# EasyEDA Pro project usb-seal.epro

# Schematic Schematic1
Board Name: Board1; Create Date: 2026-08-11; Page Name: P1; Project Name: usb-hub; Schematic Name: Schematic1; Update Date: 2026-08-11; Company: EasyEDA.com; Page Size: A4; Version: V1.0
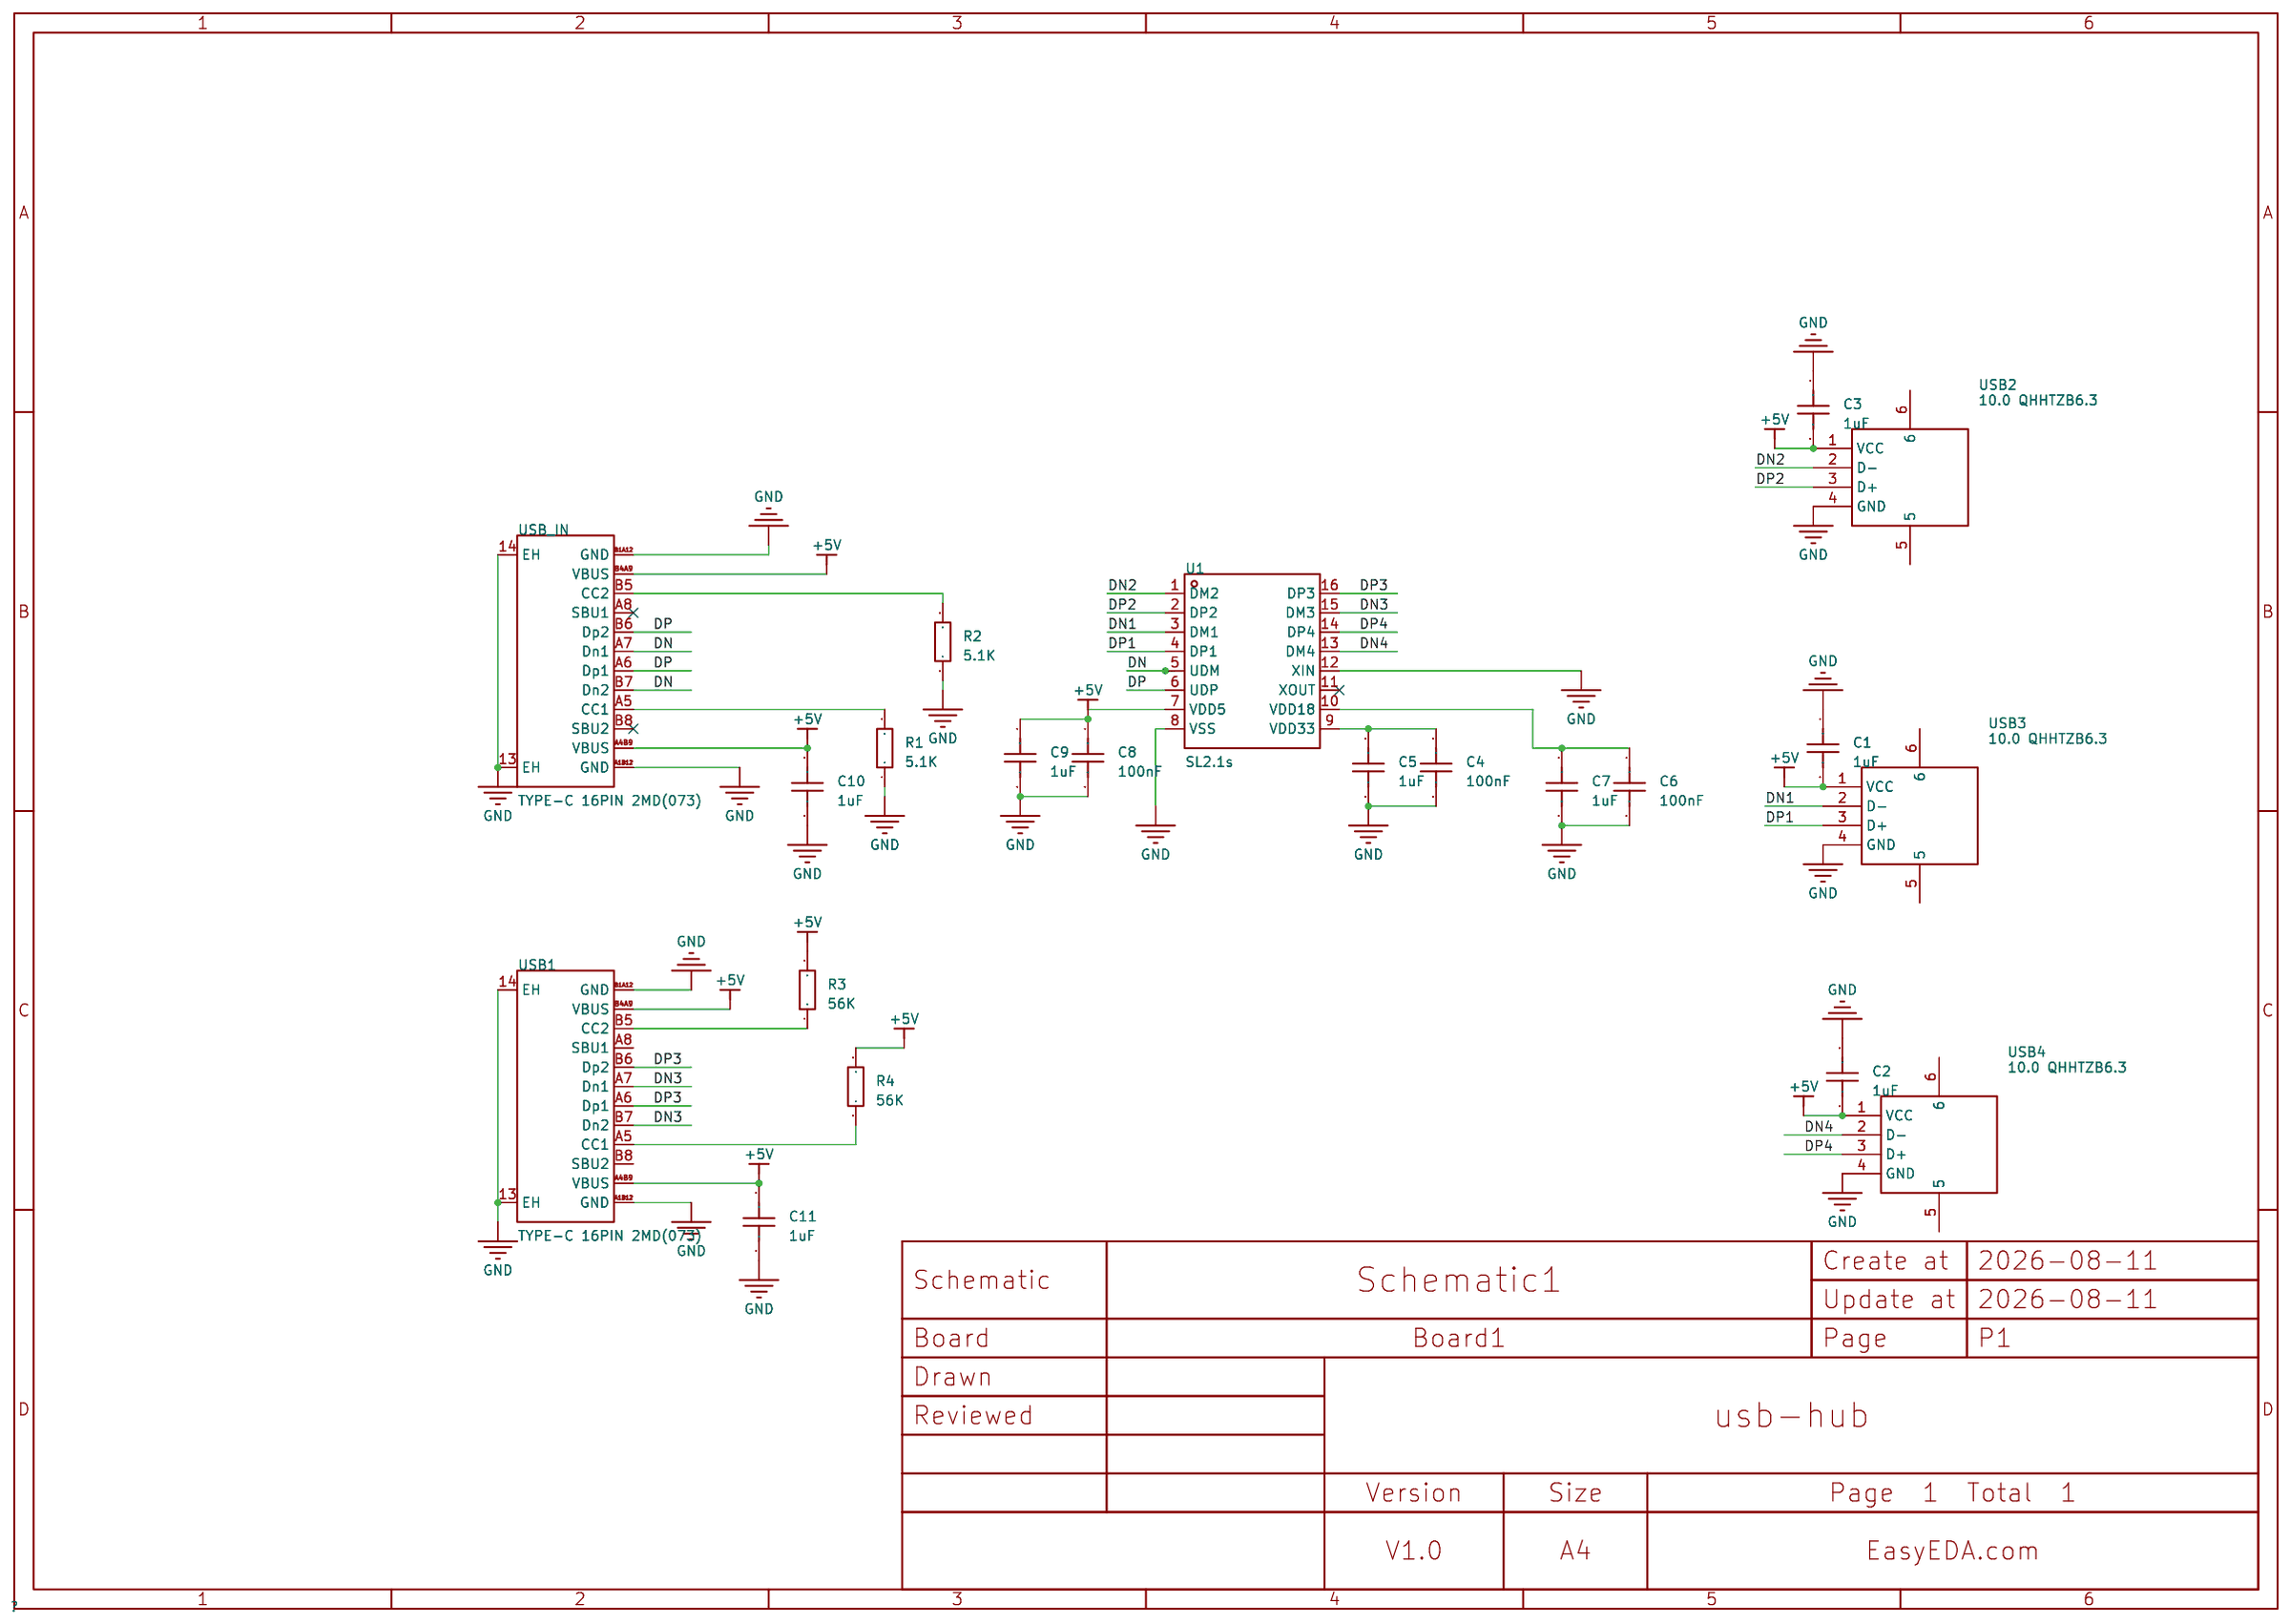
[diagram p0: schematic sheet]

## Parts
C1  1uF  [C0603]
C2  1uF  [C0603]
C3  1uF  [C0603]
C4  100nF  [C0603]
C5  1uF  [C0603]
C6  100nF  [C0603]
C7  1uF  [C0603]
C8  100nF  [C0603]
C9  1uF  [C0603]
C10  1uF  [C0603]
C11  1uF  [C0603]
R1  5.1K  [R0603]
R2  5.1K  [R0603]
R3  56K  [R0603]
R4  56K  [R0603]
U1  SL2.1s  [SSOP-16_L4.6-W2.6-P0.53-LS4.0-BL]
USB1  TYPE-C 16PIN 2MD(073)  [USB-C-SMD_TYPE-C-16PIN-2MD-073]
USB2  10.0 QHHTZB6.3  [USB-A-TH_10.0QHHTZB6.3]
USB3  10.0 QHHTZB6.3  [USB-A-TH_10.0QHHTZB6.3]
USB4  10.0 QHHTZB6.3  [USB-A-TH_10.0QHHTZB6.3]
USB_IN  TYPE-C 16PIN 2MD(073)  [USB-C-SMD_TYPE-C-16PIN-2MD-073]

## Library data of the parts
C1-C11 = CAP_0603: Supplier Footprint: 0603
R1-R4 = Res_0603: Supplier Footprint: 0603
U1 = SL2.1s: type:Hub USB Protocol:USB 2.0 Data Rate:- Voltage - Supply:4V~5.25V Voltage - Supply:4V~5.25V Operating Temperature:0℃~+70℃ Operating Temperature:0℃~+70℃ Memory Interface:- Current - Supply:120mA Quiescent Supply Current:2.5mA Number of Channels:4; LCSC Part Name: USB2.0 HUB控制器集成电路; Supplier Part: C2684433; Manufacturer: CoreChips(和芯润德); Supplier Footprint: SSOP-16; JLCPCB Part Class: Extended Part; Datasheet: https://item.szlcsc.com/datasheet/SL2.1s/2782346.html; Supplier: LCSC; type: Hub; USB Protocol: USB 2.0; Voltage - Supply: 4V~5.25V; Operating Temperature: 0℃~+70℃; Current - Supply: 120mA; Quiescent Supply Current: 2.5mA; Number of Channels: 4
USB1 USB_IN = TYPE-C 16PIN 2MD(073): Connector Type:Type-C Protocol Standard:- Gender:Female Mounting Type:Surface Mount, Right Angle Number of Contacts:16P Number of Ports:1 Current Rating-Power:3A Voltage Rating:5V Connect-Disconnect Life:10,000 cycles Supplementary Features:- Center Heigh; LCSC Part Name: Type-C 母 卧贴; Supplier Part: C2765186; Manufacturer: SHOU HAN(首韩); Supplier Footprint: SMD; JLCPCB Part Class: Extended Part; Datasheet: https://item.szlcsc.com/datasheet/TYPE-C%252016PIN%25202MD(073)/2901843.html; Supplier: LCSC; Connector Type: Type-C; Gender: Female; Mounting Type: Surface Mount, Right Angle; Number of Contacts: 16P; Number of Ports: 1; Current Rating-Power: 3A; Voltage Rating: 5V; Connect-Disconnect Life: 10,000 cycles; Detection color: Black; Operating Temperature: -25℃~+85℃
USB2-USB4 = 10.0 QHHTZB6.3: Connector Type:Type-A Protocol Standard:USB 2.0 Gender:Female Mounting Type:Surface Mount, Right Angle Number of Contacts:4P Number of Ports:1 Current Rating-Power:1.5A Voltage Rating:30V Connect-Disconnect Life:5,000 times Supplementary Features:- Center; LCSC Part Name: 壳长10.0mm; Supplier Part: C668591; Manufacturer: SHOU HAN(首韩); Supplier Footprint: SMD; JLCPCB Part Class: Extended Part; Datasheet: https://item.szlcsc.com/datasheet/10.0%2520QHHTZB6.3/698534.html; Supplier: LCSC; Connector Type: Type-A; Protocol Standard: USB 2.0; Gender: Female; Mounting Type: Surface Mount, Right Angle; Number of Contacts: 4P; Number of Ports: 1; Current Rating-Power: 1.5A; Voltage Rating: 30V; Connect-Disconnect Life: 5,000 times; Length: 10mm; Detection color: Black; Operating Temperature: -25℃~+85℃

## Nets
+5V: C1.2 C2.2 C3.2 C8.1 C9.1 C10.2 C11.2 R3.2 R4.2 U1.7(VDD5) USB1.A4B9(VBUS) USB1.B4A9(VBUS) USB2.1(VCC) USB3.1(VCC) USB4.1(VCC) USB_IN.A4B9(VBUS) USB_IN.B4A9(VBUS)
GND: C1.1 C2.1 C3.1 C4.2 C5.2 C6.2 C7.2 C8.2 C9.2 C10.1 C11.1 R1.1 R2.1 U1.8(VSS) U1.12(XIN) USB1.13(EH) USB1.14(EH) USB1.A1B12(GND) USB1.B1A12(GND) USB2.4(GND) USB3.4(GND) USB4.4(GND) USB_IN.13(EH) USB_IN.14(EH) USB_IN.A1B12(GND) USB_IN.B1A12(GND)
DN: U1.5(UDM) USB_IN.A7(Dn1) USB_IN.B7(Dn2)
DN1: U1.3(DM1) USB3.2(D-)
DN2: U1.1(DM2) USB2.2(D-)
DN3: U1.15(DM3) USB1.A7(Dn1) USB1.B7(Dn2)
DN4: U1.13(DM4) USB4.2(D-)
DP: U1.6(UDP) USB_IN.A6(Dp1) USB_IN.B6(Dp2)
DP1: U1.4(DP1) USB3.3(D+)
DP2: U1.2(DP2) USB2.3(D+)
DP3: U1.16(DP3) USB1.A6(Dp1) USB1.B6(Dp2)
DP4: U1.14(DP4) USB4.3(D+)
$1N12: R1.2 USB_IN.A5(CC1)
$1N15: R2.2 USB_IN.B5(CC2)
$1N69: R3.1 USB1.B5(CC2)
$1N70: R4.1 USB1.A5(CC1)
$1N80: C4.1 C5.1 U1.9(VDD33)
$1N83: C6.1 C7.1 U1.10(VDD18)

Not connected (* = marked no-connect by the designer): U1 11(XOUT)*; USB1 A8(SBU1) B8(SBU2); USB2 5 6; USB3 5 6; USB4 5 6; USB_IN A8(SBU1)* B8(SBU2)*

# Board PCB1
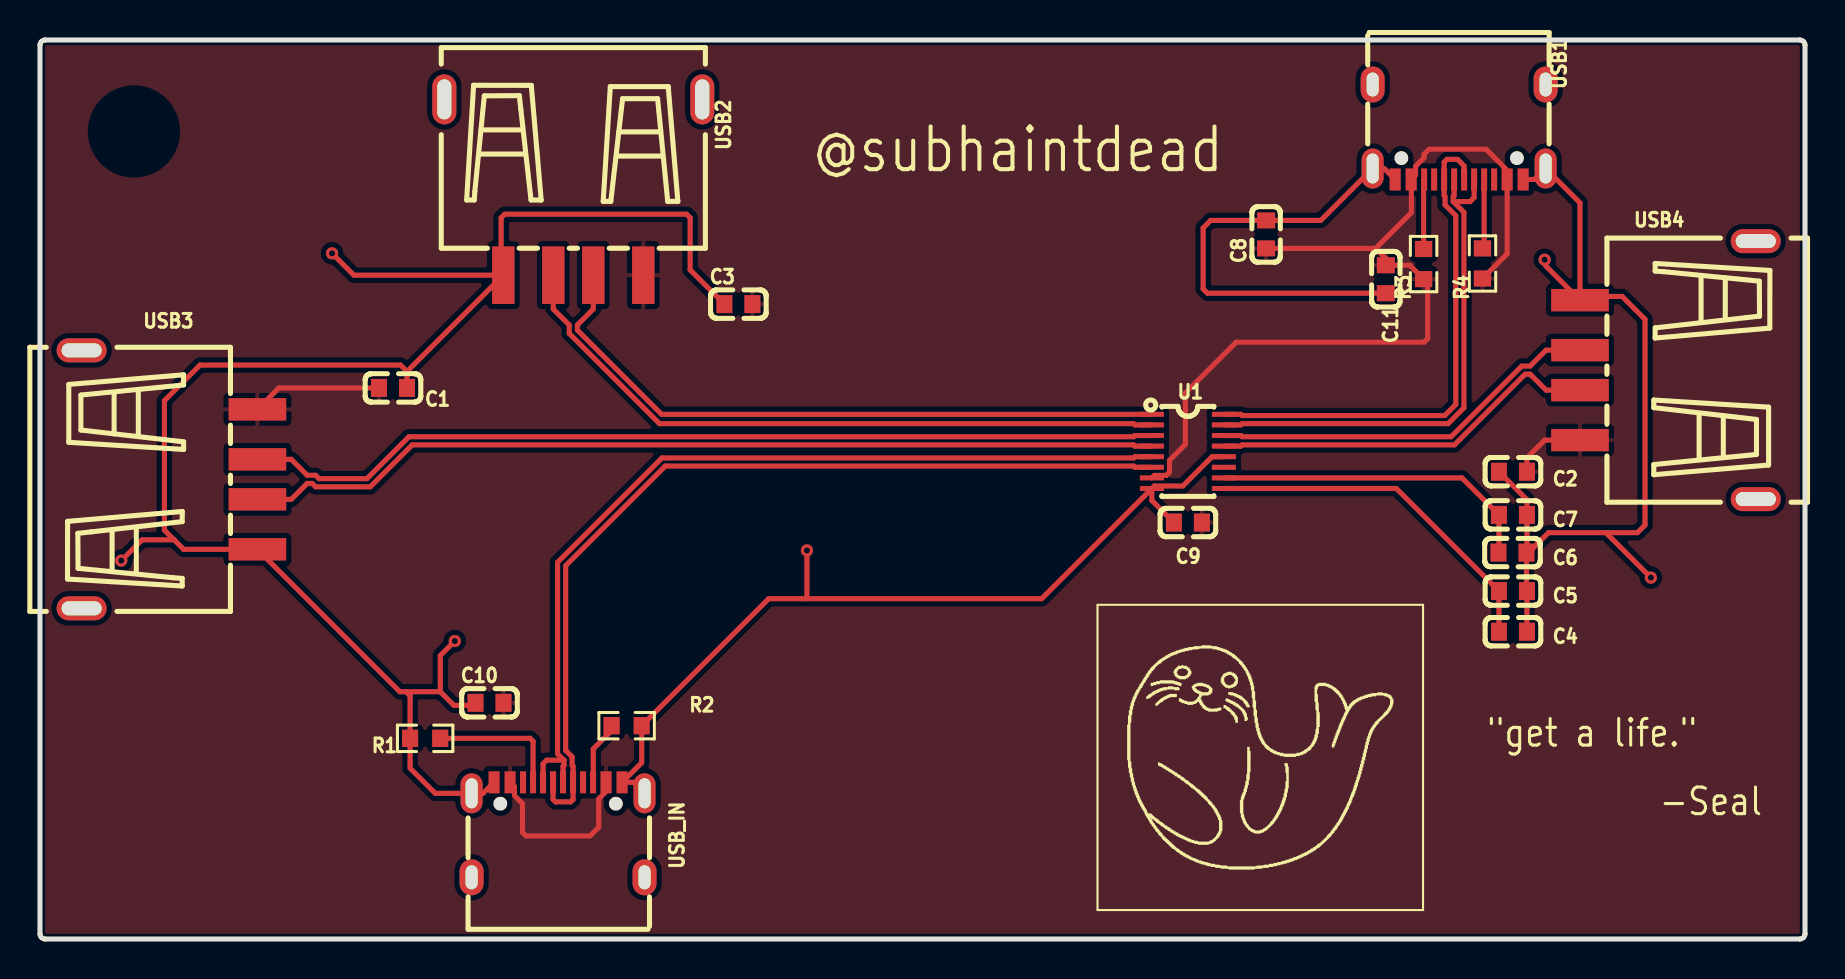
[diagram p1: board, top side]
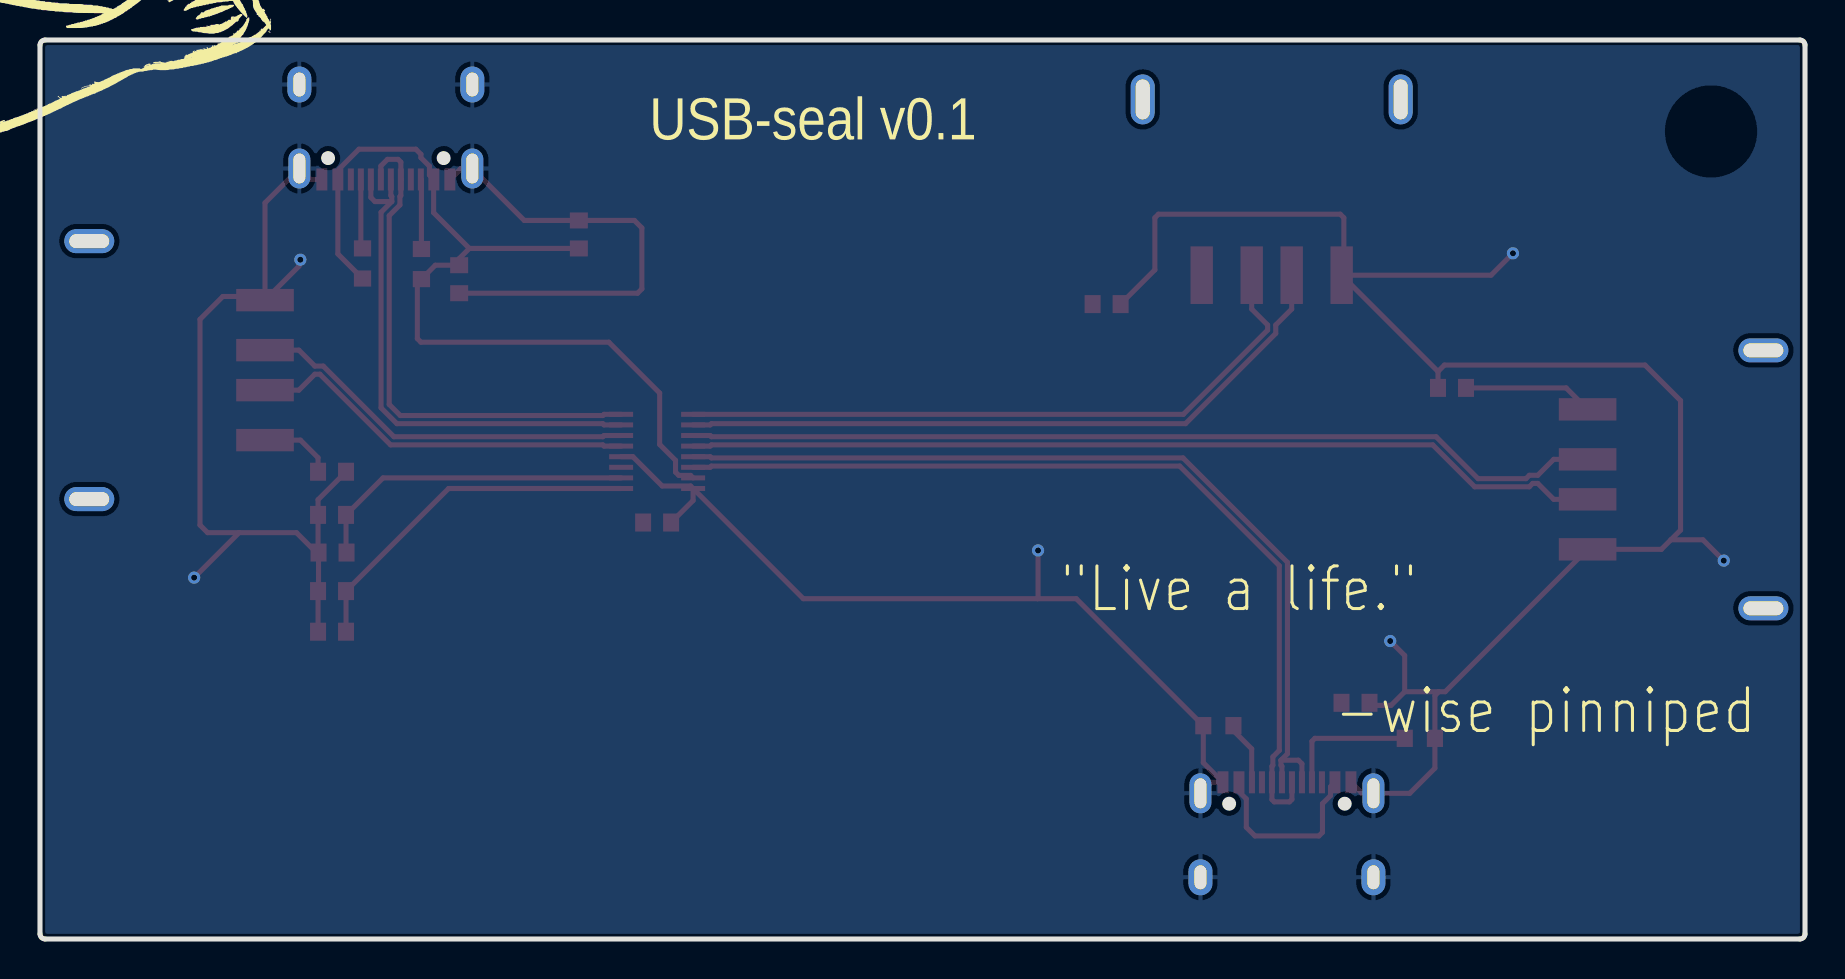
[diagram p2: board, bottom side, seen from below]

Outline 88.27 x 44.96 mm; copper layers: Top Layer, Bottom Layer. Coordinates in mm from the lower left corner of the outline.
Outline path: 0,44.7 0,0.25 arc(0.07,0.07) 0.25,0 88.01,0 arc(88.19,0.07) 88.27,0.25 88.27,44.7 arc(88.19,44.88) 88.01,44.96 0.25,44.96 arc(0.07,44.88) 0,44.7
Stack: Top Layer 0.035mm / Dielectric1 1.51mm FR4 er 4.5 / Bottom Layer 0.035mm

## Design rules (mm)
net DN2: DP4
net DP2: DP4
net DN1: DP5
net DP1: DP5
net DN: DP1
net DP: DP1
net DN4: DP2
net DP4: DP2
net DN3: DP3
net DP3: DP3
spacing copperThickness1oz (default): track to track 0.102, other pairs 0.152 to 0.3
spacing copperThickness2oz: track to track 0.203, other pairs 0.152 to 0.3
track width copperThickness1oz (default): min 0.127, default 0.254, max 2.54
track width copperThickness2oz: min 0.203, default 0.254, max 2.54
differential pair differentialPair (default): width min 0.127, default 0.254, max 2.54; gap min 0.152, default 0.152
net GND uses copperRegion
net +5V uses copperRegion

## Placement (name value [footprint] x y rotation side)
C1  1uF  [C0603]  17.65 27.56 180 top
C2  1uF  [C0603]  73.66 23.37 0 top
C3  1uF  [C0603]  34.92 31.75 0 top
C4  100nF  [C0603]  73.66 15.37 0 top
C5  1uF  [C0603]  73.66 17.4 0 top
C6  100nF  [C0603]  73.64 19.32 0 top
C7  1uF  [C0603]  73.66 21.21 0 top
C8  100nF  [C0603]  61.32 35.23 90 top
C9  1uF  [C0603]  57.4 20.83 180 top
C10  1uF  [C0603]  22.48 11.81 0 top
C11  1uF  [C0603]  67.3 32.99 90 top
R1  5.1K  [R0603]  19.26 10.04 0 top
R2  5.1K  [R0603]  29.34 10.67 180 top
R3  56K  [R0603]  69.19 33.75 270 top
R4  56K  [R0603]  72.14 33.78 270 top
U1  SL2.1s  [SSOP-16_L4.6-W2.6-P0.53-LS4.0-BL]  57.4 24.38 270 top
USB1  TYPE-C 16PIN 2MD(073)  [USB-C-SMD_TYPE-C-16PIN-2MD-073]  70.97 40.36 180 top
USB2  10.0 QHHTZB6.3  [USB-A-TH_10.0QHHTZB6.3]  26.67 37.59 180 top
USB3  10.0 QHHTZB6.3  [USB-A-TH_10.0QHHTZB6.3]  6.48 22.99 270 top
USB4  10.0 QHHTZB6.3  [USB-A-TH_10.0QHHTZB6.3]  81.41 28.45 90 top
USB_IN  TYPE-C 16PIN 2MD(073)  [USB-C-SMD_TYPE-C-16PIN-2MD-073]  25.91 5.46 0 top

## Footprints (pads in the part's own frame, mm; a bottom-side part is the same pattern mirrored in y, then rotated)
C0603
  rect 0.8x0.9 smd: 1(-0.7,0) 2(0.7,0)
R0603
  rect 0.806x0.864 smd: 1(-0.753,0) 2(0.753,0)
SSOP-16_L4.6-W2.6-P0.53-LS4.0-BL
  rect 0.25x1.2 smd: 1(-1.855,-1.8) 2(-1.325,-1.8) 3(-0.795,-1.8) 4(-0.265,-1.8) 5(0.265,-1.8) 6(0.795,-1.8) 7(1.325,-1.8) 8(1.855,-1.8) 9(1.855,1.8) 10(1.325,1.8) 11(0.795,1.8) 12(0.265,1.8) 13(-0.265,1.8) 14(-0.795,1.8) 15(-1.325,1.8) 16(-1.855,1.8)
USB-A-TH_10.0QHHTZB6.3
  rect 1.12x2.88 smd: 1(-3.5,4.395) 2(-1,4.395) 3(1,4.395) 4(3.5,4.395)
  oval 1.2x2.5 hole 0.7x2: 5(-6.45,-4.395) 6(6.45,-4.395)
USB-C-SMD_TYPE-C-16PIN-2MD-073
  oval 1.1x2 hole 0.6x1.5: 13(-4.325,1.825) 14(4.325,1.825)
  oval 1.2x1.8 hole 0.6x1.2: 13(-4.325,-2.375) 14(4.325,-2.375)
  rect 0.55x1.1 smd: A1B12(-3.2,2.375) A4B9(-2.4,2.375) B1A12(3.2,2.375) B4A9(2.4,2.375)
  rect 0.3x1.1 smd: A5(-1.25,2.375) A6(-0.25,2.375) A7(0.25,2.375) A8(1.25,2.375) B5(1.75,2.375) B6(0.75,2.375) B7(-0.75,2.375) B8(-1.75,2.375)

## Nets
As in the schematic.

Pads without a net: U1 11; USB1 A8 B8; USB2 5 6; USB3 5 6; USB4 5 6; USB_IN A8 B8

## Via types
v1: diameter 0.61, hole 0.305, Top Layer to Bottom Layer, 6 vias

## Routing (per net, layer and track width the routed paths; a pad name or vN(x,y) marks a point on that pad's centre or on a via; arc(x,y) is an arc through that point)
+5V: length 65.1
  Top Layer w0.254: 77.01,24.95 75.24,24.95 74.36,24.07 C2.2 ; 73.3,38.51 72.32,39.5 69.47,39.5 69.22,39.24 69.22,39.07 68.79,38.65 68.79,38.2 USB1.B4A9 68.58,37.97 68.58,36.32 66.79,34.53 ; R4.2 73.37,34.26 USB1.A4B9 ; C8.1 66.79,34.53 ; 66.79,34.53 67.3,34.02 C11.2 68.5,33.69 R3.2 69.39,32.8 69.39,30.02 69.22,29.84 59.82,29.84 57.28,27.3 57.28,24.73 56.48,23.94 56.48,23.35 56.32,23.18 55.73,23.18 U1.7 ; C1.2 11.94,27.56 USB3.1 ; 23.51,7.84 23.73,7.61 23.73,7.17 24.13,6.77 24.13,5.33 24.31,5.15 27.51,5.15 27.94,5.59 27.94,7.01 28.31,7.38
GND: length 198.6
  Top Layer w0.254: 18.31,12.37 18.51,12.17 R1.1 18.51,8.54 19.77,7.29 USB_IN.13 22.16,7.29 USB_IN.A1B12 ; 18.31,12.37 17.99,12.37 USB3.4 7.18,19.49 6.71,19.96 ; 18.31,12.37 20.02,12.37 ; 55.6,22.53 55.6,21.93 C9.2 ; 55.6,22.53 50.09,17.02 38.38,17.02 ; 55.6,22.53 55.73,22.65 57.15,22.65 58.61,24.12 U1.12 ; v1(75.25,33.97) 75.31,33.9 75.31,33.65 77.01,31.95 ; 77.01,31.95 77.2,32.13 79.12,32.13 80.26,30.99 80.26,20.7 79.88,20.32 78.31,20.32 ; 77.01,31.95 77.01,36.81 USB1.13 74.74,37.98 USB1.A1B12 ; USB2.4 18.35,28.38 ; USB2.4 23.06,33.31 23.06,36.07 23.24,36.25 32.33,36.25 32.51,36.07 32.51,33.46 C3.1 ; USB2.4 15.7,33.2 v1(14.61,34.29) ; 18.35,28.38 18.03,28.7 8,28.7 6.22,26.92 6.22,20.45 6.71,19.96 ; 18.35,28.38 C1.1 ; v1(4.06,18.92) 5.11,19.96 6.71,19.96 ; 74.49,19.37 74.44,19.32 C6.2 74.34,17.42 C5.2 C4.2 ; 74.49,19.37 75.44,20.32 78.31,20.32 ; 74.49,19.37 74.36,19.49 C7.2 74.36,21.97 C2.1 ; 20.02,12.37 20.02,14.18 v1(20.74,14.9) ; 20.02,12.37 20.7,11.68 21.65,11.68 C10.1 ; USB1.B1A12 67.22,38.53 USB1.14 64.05,35.93 C8.2 58.54,35.93 58.17,35.56 58.17,32.51 58.38,32.29 C11.1 ; 78.31,20.32 v1(80.56,18.07) ; 38.38,17.02 36.44,17.02 R2.1 30.09,8.82 29.11,7.84 29.68,7.84 USB_IN.14 ; 38.38,17.02 38.35,17.04 v1(38.35,19.43)
DN: length 45.1
  Top Layer w0.254: USB_IN.B7 25.16,8.76 25.34,8.94 26.2,8.94 ; 26.2,8.94 25.88,9.26 25.88,18.84 31.1,24.06 54.69,24.06 54.75,24.12 U1.5 ; 26.2,8.94 26.2,8.94 26.2,8.69 26.16,8.64 USB_IN.A7
DN1: length 46
  Top Layer w0.254: USB3.2 12.57,23.99 13.36,23.19 13.79,23.19 13.95,23.02 16.35,23.02 18.45,25.12 54.69,25.12 54.75,25.18 U1.3
DN2: length 33.6
  Top Layer w0.254: USB2.2 27.67,31.5 26.87,30.71 26.87,30.45 31.09,26.24 U1.1
DN3: length 26
  Top Layer w0.254: U1.15 60.06,25.71 60.12,25.77 70.41,25.77 71.21,26.56 71.21,36.34 70.67,36.88 ; 70.67,36.88 70.67,37.13 70.72,37.18 USB1.A7 ; 70.67,36.88 71.51,36.88 71.72,37.08 USB1.B7
DN4: length 19.6
  Top Layer w0.254: U1.13 60.06,24.65 60.12,24.71 70.73,24.71 74.27,28.24 74.52,28.24 75.32,27.45 77.01,27.45
DP: length 45.2
  Top Layer w0.254: USB_IN.A6 25.66,6.98 25.78,6.86 26.54,6.86 26.66,6.97 26.66,7.83 ; USB_IN.B6 26.66,8.64 26.61,8.69 26.61,9.11 26.29,9.43 26.29,18.67 31.27,23.65 54.69,23.65 54.75,23.59 55.6,23.59
DP1: length 46
  Top Layer w0.254: USB3.3 12.57,21.99 13.36,22.78 13.62,22.78 13.79,22.61 16.52,22.61 18.62,24.71 54.69,24.71 54.75,24.65 U1.4
DP2: length 34.3
  Top Layer w0.254: U1.2 54.75,25.71 54.69,25.77 30.98,25.77 26.47,30.28 26.47,30.71 25.67,31.5 USB2.3
DP3: length 26.1
  Top Layer w0.254: USB1.A6 71.22,38.66 70.89,38.99 70.36,38.99 70.22,38.85 USB1.B6 70.22,37.18 70.27,37.13 70.27,36.71 70.8,36.17 70.8,26.73 70.25,26.18 60.12,26.18 60.06,26.24 U1.16
DP4: length 19.6
  Top Layer w0.254: 77.01,29.45 75.32,29.45 74.52,28.65 74.1,28.65 70.57,25.12 60.12,25.12 60.06,25.18 U1.14
$1N12: length 6.8
  Top Layer w0.254: USB_IN.A5 24.66,9.89 24.51,10.04 R1.2
$1N15: length 3.2
  Top Layer w0.254: USB_IN.B5 27.67,7.85 27.67,9.51 28.58,10.42 R2.2
$1N69: length 3.5
  Top Layer w0.254: USB1.B5 69.19,37.95 R3.1
$1N70: length 3.5
  Top Layer w0.254: R4.1 72.22,34.62 USB1.A5
$1N80: length 17.9
  Top Layer w0.254: C4.1 C5.1 67.83,22.53 59.2,22.53
$1N83: length 16.4
  Top Layer w0.254: C6.1 72.96,19.35 C7.1 71.11,23.06 U1.10

## Copper pours and planes (outline as drawn; the poured copper is in the pictures)
+5V on Top Layer: -8,47.37 94.74,47.37 94.74,-10.92 -8,-10.92
GND on Bottom Layer: -3.05,46.61 92.2,46.61 92.2,-1.02 -3.05,-1.02

## Text on the board
Bottom Silkscreen Layer: -wise pinniped | "Live a life." | USB-seal v0.1
Top Silkscreen Layer: "get a life." | -Seal | @subhaintdead
